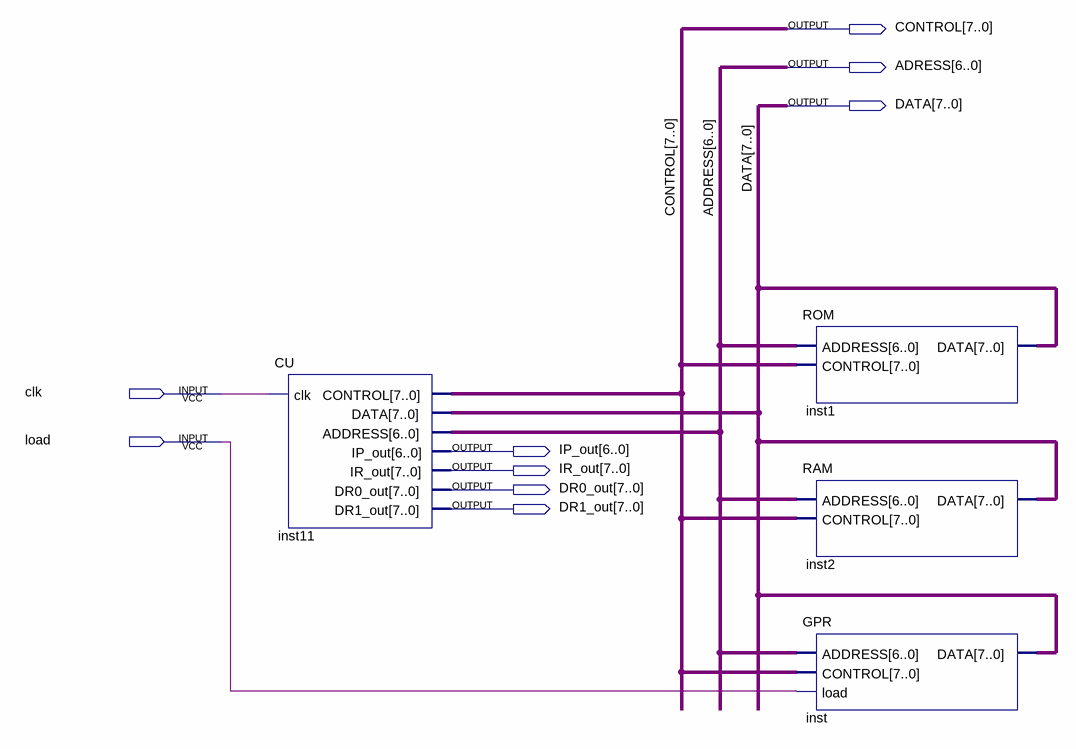
[diagram p0: schematic sheet]
// Quartus schematic lab4.bdf as structural Verilog: 4 symbols, 9 pins
module lab4 (
  input  clk,
  input  load,
  output [7:0] CONTROL,
  output [6:0] ADRESS,
  output [7:0] DATA,
  output [6:0] IP_out,
  output [7:0] IR_out,
  output [7:0] DR0_out,
  output [7:0] DR1_out
);

  CU inst11 (
    .clk(clk), .CONTROL(CONTROL), .ADDRESS(ADRESS), .IP_out(IP_out), .IR_out(IR_out), .DR0_out(DR0_out),
    .DR1_out(DR1_out), .DATA(DATA));
  ROM inst1 (.ADDRESS(ADRESS), .CONTROL(CONTROL), .DATA(DATA));
  RAM inst2 (.ADDRESS(ADRESS), .CONTROL(CONTROL), .DATA(DATA));
  GPR inst (.ADDRESS(ADRESS), .CONTROL(CONTROL), .load(load), .DATA(DATA));

  // Other names for the same wires on the sheet: ADDRESS[6:0] = ADRESS
endmodule
